# EAGLE design motor kontrol v1 (EAGLE 9.6.2)
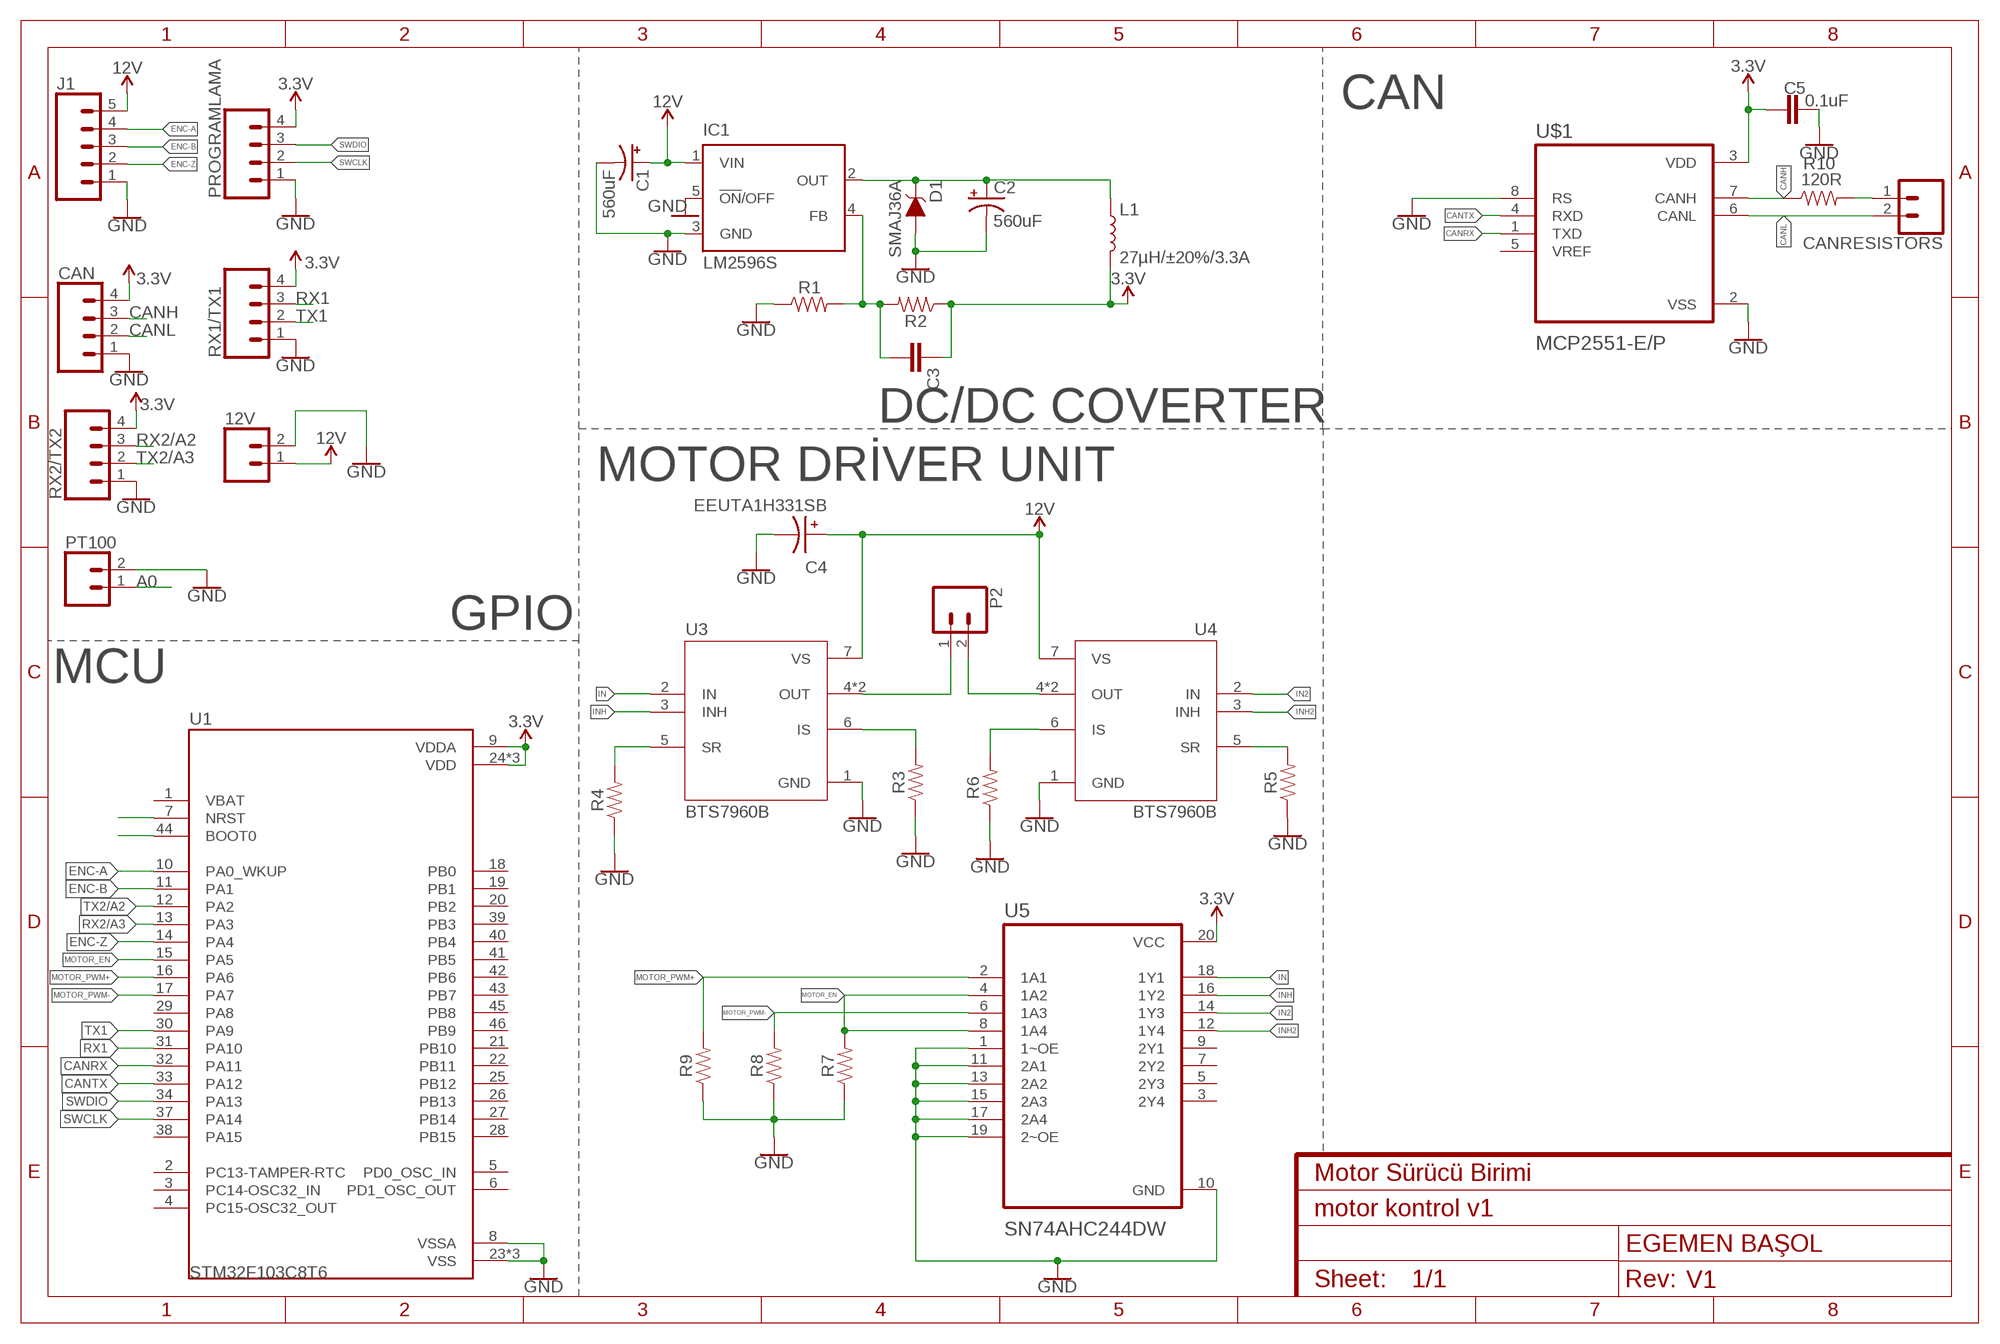
[diagram p0: schematic, sheet 1]
FRAME1 (FRAME-A4L): CNAME: Motor Sürücü Birimi; CREVISION: V1; DESIGNER: EGEMEN BAŞOL

## Parts
12V  CONN_023.5MM_LOCK  [SCREWTERMINAL-3.5MM-2_LOCK]
C1  560uF  560UF-PANASONIC_G-25V-20%  [PANASONIC_G]
C2  560uF  560UF-PANASONIC_G-25V-20%  [PANASONIC_G]
C3  CAP-0805  [0805]
C4  EEUTA1H331SB  [CAPPRD750W80D1600H1500]
C5  0.1uF  CAP-0805  [0805]
CAN  CONN_04SCREW_LOCK  [SCREWTERMINAL-3.5MM-4_LOCK]
CANRESISTORS  CONN_02LOCK_LONGPADS  [1X02_LOCK_LONGPADS]
D1  SMAJ36A  DIODE_TVS_UNI  [DO-214AC]
IC1  LM2596S  [TO263-5]
J1  CONN_05SCREW  [SCREWTERMINAL-3.5MM-5]
L1  27µH/±20%/3.3A  INDUCTOR-SDR13-27UH  [INDUCTOR_SDR1307]
P2  CONN_023.5MM_LOCK  [SCREWTERMINAL-3.5MM-2_LOCK]
PROGRAMLAMA  CONN_04SCREW_LOCK  [SCREWTERMINAL-3.5MM-4_LOCK]
PT100  CONN_023.5MM_LOCK  [SCREWTERMINAL-3.5MM-2_LOCK]
R1  RESISTOR0805  [0805]
R2  RESISTOR0805  [0805]
R3  RESISTOR0805  [0805]
R4  RESISTOR0805  [0805]
R5  RESISTOR0805  [0805]
R6  RESISTOR0805  [0805]
R7  RESISTOR0805  [0805]
R8  RESISTOR0805  [0805]
R9  RESISTOR0805  [0805]
R10  120R  RESISTOR0805  [0805]
RX1/TX1  CONN_04SCREW_LOCK  [SCREWTERMINAL-3.5MM-4_LOCK]
RX2/TX2  CONN_04SCREW_LOCK  [SCREWTERMINAL-3.5MM-4_LOCK]
U1  STM32F103C8T6  [QFP50P900X900X160-48N]
U3  BTS7960B  [DPAK127P1490X440-8N]
U4  BTS7960B  [DPAK127P1490X440-8N]
U5  SN74AHC244DW  [SOIC127P1030X265-20N]
U$1  MCP2551-E/P  [DIP787W46P254L927H533Q8]

## Nets
3.3V: C3.1 C5.2 CAN.4 L1.P$2 PROGRAMLAMA.4 R2.1 RX1/TX1.4 RX2/TX2.4 U1.9(VDDA) U1.24(VDD) U1.36(VDD) U1.48(VDD) U5.20(VCC) U$1.3(VDD)
12V: 12V.1 C1.+ C4.P IC1.1(VIN) J1.5 U3.7(VS) U4.7(VS)
A0: PT100.1
CANH: CAN.3 R10.1 U$1.7(CANH)
CANL: CAN.2 CANRESISTORS.2 U$1.6(CANL)
CANRX: U1.32(PA11) U$1.1(TXD)
CANTX: U1.33(PA12) U$1.4(RXD)
ENC-A: J1.4 U1.10(PA0_WKUP)
ENC-B: J1.3 U1.11(PA1)
ENC-Z: J1.2 U1.14(PA4)
GND: 12V.2 C1.- C2.- C4.N C5.1 CAN.1 D1.A IC1.3(GND) IC1.5(!ON!/OFF) J1.1 PROGRAMLAMA.1 PT100.2 R1.1 R3.1 R4.1 R5.1 R6.1 R7.1 R8.1 R9.1 RX1/TX1.1 RX2/TX2.1 U1.8(VSSA) U1.23(VSS) U1.35(VSS) U1.47(VSS) U3.1(GND) U4.1(GND) U5.1(1~OE) U5.10(GND) U5.11(2A1) U5.13(2A2) U5.15(2A3) U5.17(2A4) U5.19(2~OE) U$1.2(VSS) U$1.8(RS)
IN: U3.2(IN) U5.18(1Y1)
IN2: U4.2(IN) U5.14(1Y3)
INH: U3.3(INH) U5.16(1Y2)
INH2: U4.3(INH) U5.12(1Y4)
MOTOR_EN: R7.2 U1.15(PA5) U5.4(1A2) U5.8(1A4)
MOTOR_PWM+: R9.2 U1.16(PA6) U5.2(1A1)
MOTOR_PWM-: R8.2 U1.17(PA7) U5.6(1A3)
N$1: C2.+ D1.C IC1.2(OUT) L1.P$1
N$2: C3.2 IC1.4(FB) R1.2 R2.2
N$3: P2.1 U3.4(OUT) U3.8(OUT)
N$4: P2.2 U4.4(OUT) U4.8(OUT)
N$5: CANRESISTORS.1 R10.2
N$6: R5.2 U4.5(SR)
N$7: R6.2 U4.6(IS)
N$8: R3.2 U3.6(IS)
N$9: R4.2 U3.5(SR)
N$10: U1.7(NRST)
N$11: U1.44(BOOT0)
RX1: RX1/TX1.3 U1.31(PA10)
RX2/A2: RX2/TX2.3
RX2/A3: U1.13(PA3)
SWCLK: PROGRAMLAMA.2 U1.37(PA14)
SWDIO: PROGRAMLAMA.3 U1.34(PA13)
TX1: RX1/TX1.2 U1.30(PA9)
TX2/A2: U1.12(PA2)
TX2/A3: RX2/TX2.2
Unconnected: U1.1(VBAT) U1.2(PC13-TAMPER-RTC) U1.3(PC14-OSC32_IN) U1.4(PC15-OSC32_OUT) U1.5(PD0_OSC_IN) U1.6(PD1_OSC_OUT) U1.18(PB0) U1.19(PB1) U1.20(PB2) U1.21(PB10) U1.22(PB11) U1.25(PB12) U1.26(PB13) U1.27(PB14) U1.28(PB15) U1.29(PA8) U1.38(PA15) U1.39(PB3) U1.40(PB4) U1.41(PB5) U1.42(PB6) U1.43(PB7) U1.45(PB8) U1.46(PB9) U5.3(2Y4) U5.5(2Y3) U5.7(2Y2) U5.9(2Y1) U$1.5(VREF)

## Notes on the sheet
- CAN
- DC/DC COVERTER
- MOTOR DRİVER UNIT
- GPIO
- MCU

## Library data of the parts
12V P2 PT100 = SparkFun-Connectors:CONN_02: Multi connection point. Often used as Generic Header-pin footprint for 0.1 inch spaced/style header connections On any of the 0.1 inch spaced packages, you can populate with these: Break Away Headers - Straight <https://www.sparkfun.com/products/116> (PRT-00116) Break Away Male Headers - Right Angle <https://www.sparkfun.com/products/553> (PRT-00553) Female Headers <https://www.sparkfun.com/products/115> (PRT-00115) Break Away Headers - Machine Pin <https://www.sparkfun.com/products/117> (PRT-00117) Break Away Female Headers - Swiss Machine Pin <https://www.sparkfun.com/products/743> (PRT-00743) For SCREWTERMINALS and SPRING TERMINALS visit here: Screw Terimnals on SparkFun.com <https://www.sparkfun.com/search/results?term=Screw+Terminals> (5mm/3.5mm/2.54mm spacing) This device is also useful as a general connection point to wire up your design to another part of your project. Our various solder wires solder well into these plated through hole pads. Hook-Up Wire - Assortment (Stranded, 22 AWG) <https://www.sparkfun.com/products/11375> (PRT-11375) Hook-Up Wire - Assortment (Solid Core, 22 AWG) <https://www.sparkfun.com/products/11367> (PRT-11367) View the entire wire category on our website here <https://www.sparkfun.com/categories/141> Special notes: Molex polarized connector foot print use with: PRT-08233 with associated crimp pins and housings. 2.54_SCREWTERM for use with PRT-10571. 3.5mm Screw Terminal footprints for PRT-08084 5mm Screw Terminal footprints for use with PRT-08432; PROD_ID: CONN-08399
C1 C2 = SparkFun-Capacitors:560UF: 560µF polarized capacitors A capacitor is a passive two-terminal electrical component used to store electrical energy temporarily in an electric field.; PROD_ID: CAP-09983
C3 C5 = SparkFun-Capacitors:CAP
C4 = EEUTA1H331SB:EEUTA1H331SB: TA-A Check availability <https://pricing.snapeda.com/parts/EEUTA1H331SB/Panasonic/view-part?ref=eda>; AVAILABILITY: In Stock; DESCRIPTION: CAP ALUM 330UF 20% 50V RADIAL; MF: Panasonic; MP: EEUTA1H331SB; PACKAGE: RADIAL-2 Panasonic; PRICE: None; PURCHASE-URL: https://pricing.snapeda.com/search/part/EEUTA1H331SB/?ref=eda
CAN PROGRAMLAMA RX1/TX1 RX2/TX2 = SparkFun-Connectors:CONN_04: Multi connection point. Often used as Generic Header-pin footprint for 0.1 inch spaced/style header connections On any of the 0.1 inch spaced packages, you can populate with these: Break Away Headers - Straight <https://www.sparkfun.com/products/116> (PRT-00116) Break Away Male Headers - Right Angle <https://www.sparkfun.com/products/553> (PRT-00553) Female Headers <https://www.sparkfun.com/products/115> (PRT-00115) Break Away Headers - Machine Pin <https://www.sparkfun.com/products/117> (PRT-00117) Break Away Female Headers - Swiss Machine Pin <https://www.sparkfun.com/products/743> (PRT-00743) For SCREWTERMINALS and SPRING TERMINALS visit here: Screw Terimnals on SparkFun.com <https://www.sparkfun.com/search/results?term=Screw+Terminals> (5mm/3.5mm/2.54mm spacing) This device is also useful as a general connection point to wire up your design to another part of your project. Our various solder wires solder well into these plated through hole pads. Hook-Up Wire - Assortment (Stranded, 22 AWG) <https://www.sparkfun.com/products/11375> (PRT-11375) Hook-Up Wire - Assortment (Solid Core, 22 AWG) <https://www.sparkfun.com/products/11367> (PRT-11367) View the entire wire category on our website here <https://www.sparkfun.com/categories/141> Special notes: Molex polarized connector foot print use with SKU : PRT-08231 with associated crimp pins and housings. 1MM SMD Version SKU: PRT-10208
CANRESISTORS = SparkFun-Connectors:CONN_02: Multi connection point. Often used as Generic Header-pin footprint for 0.1 inch spaced/style header connections On any of the 0.1 inch spaced packages, you can populate with these: Break Away Headers - Straight <https://www.sparkfun.com/products/116> (PRT-00116) Break Away Male Headers - Right Angle <https://www.sparkfun.com/products/553> (PRT-00553) Female Headers <https://www.sparkfun.com/products/115> (PRT-00115) Break Away Headers - Machine Pin <https://www.sparkfun.com/products/117> (PRT-00117) Break Away Female Headers - Swiss Machine Pin <https://www.sparkfun.com/products/743> (PRT-00743) For SCREWTERMINALS and SPRING TERMINALS visit here: Screw Terimnals on SparkFun.com <https://www.sparkfun.com/search/results?term=Screw+Terminals> (5mm/3.5mm/2.54mm spacing) This device is also useful as a general connection point to wire up your design to another part of your project. Our various solder wires solder well into these plated through hole pads. Hook-Up Wire - Assortment (Stranded, 22 AWG) <https://www.sparkfun.com/products/11375> (PRT-11375) Hook-Up Wire - Assortment (Solid Core, 22 AWG) <https://www.sparkfun.com/products/11367> (PRT-11367) View the entire wire category on our website here <https://www.sparkfun.com/categories/141> Special notes: Molex polarized connector foot print use with: PRT-08233 with associated crimp pins and housings. 2.54_SCREWTERM for use with PRT-10571. 3.5mm Screw Terminal footprints for PRT-08084 5mm Screw Terminal footprints for use with PRT-08432
D1 = SparkFun-DiscreteSemi:DIODE_TVS_UNI; PROD_ID: DIO-15812
IC1 = national-semiconductor:LM2596: SIMPLE SWITCHER® Power Converter 150 kHz 3A Step-Down Voltage Regulator Source: http://www.national.com/ds/LM/LM2596.pdf; MF: NATIONAL SEMICONDUCTOR; MPN: LM2596S-ADJ/NOPB; OC_FARNELL: 9494367; OC_NEWARK: 41K3842
J1 = SparkFun-Connectors:CONN_05: Multi connection point. Often used as Generic Header-pin footprint for 0.1 inch spaced/style header connections On any of the 0.1 inch spaced packages, you can populate with these: Break Away Headers - Straight <https://www.sparkfun.com/products/116> (PRT-00116) Break Away Male Headers - Right Angle <https://www.sparkfun.com/products/553> (PRT-00553) Female Headers <https://www.sparkfun.com/products/115> (PRT-00115) Break Away Headers - Machine Pin <https://www.sparkfun.com/products/117> (PRT-00117) Break Away Female Headers - Swiss Machine Pin <https://www.sparkfun.com/products/743> (PRT-00743) For SCREWTERMINALS and SPRING TERMINALS visit here: Screw Terimnals on SparkFun.com <https://www.sparkfun.com/search/results?term=Screw+Terminals> (5mm/3.5mm/2.54mm spacing) This device is also useful as a general connection point to wire up your design to another part of your project. Our various solder wires solder well into these plated through hole pads. Hook-Up Wire - Assortment (Stranded, 22 AWG) <https://www.sparkfun.com/products/11375> (PRT-11375) Hook-Up Wire - Assortment (Solid Core, 22 AWG) <https://www.sparkfun.com/products/11367> (PRT-11367) View the entire wire category on our website here <https://www.sparkfun.com/categories/141> Special notes: Molex polarized connector foot print use with SKU : PRT-08231 with associated crimp pins and housings. 1MM SMD Version SKU: PRT-10208; PROD_ID: Combine 8288+8399
L1 = SparkFun-Coils:INDUCTOR: Inductors Resist changes in electrical current. Basically a coil of wire. SparkFun Products: SparkFun Load Cell Amplifier - HX711 <https://www.sparkfun.com/products/13879> IOIO-OTG - V2.2 <https://www.sparkfun.com/products/13613>; PROD_ID: NDUC-12529
R1-R10 = SparkFun-Resistors:RESISTOR: Generic Resistor Package
U1 = STM32F103C8T6:STM32F103C8T6: Mainstream Performance line, ARM Cortex-M3 MCU with 64 Kbytes Flash, 72 MHz CPU, motor control, USB and CAN Check availability <https://pricing.snapeda.com/parts/STM32F103C8T6/STMicroelectronics/view-part?ref=eda>; AVAILABILITY: In Stock; DESCRIPTION: ARM® Cortex®-M3 STM32F1 Microcontroller IC 32-Bit 72MHz 64KB (64K x 8) FLASH 48-LQFP (7x7); MF: STMicroelectronics; MP: STM32F103C8T6; PACKAGE: LQFP-48 STMicroelectronics; PRICE: None; PURCHASE-URL: https://pricing.snapeda.com/search/part/STM32F103C8T6/?ref=eda
U3 U4 = BTS7960B:BTS7960B: Half Bridge Motor Driver 7-Pin(6+Tab) TO-263 Check availability <https://pricing.snapeda.com/parts/BTS7960B/Infineon/view-part?ref=eda>; AVAILABILITY: In Stock; DESCRIPTION: Half Bridge Driver DC Motors, General Purpose DMOS PG-TO263-7-1; MF: Infineon; MP: BTS7960B; PACKAGE: TO-263 Infineon; PRICE: None; PURCHASE-URL: https://pricing.snapeda.com/search/part/BTS7960B/?ref=eda
U5 = SN74AHC244DW:SN74AHC244DW: Check availability <https://pricing.snapeda.com/parts/SN74AHC244DW/Texas%20Instruments/view-part?ref=eda>; AVAILABILITY: In Stock; DESCRIPTION: 8-ch, 2-V to 5.5-V buffers with 3-state outputs; MF: Texas Instruments; MP: SN74AHC244DW; PACKAGE: SOIC-20 Texas Instruments; PRICE: None; PURCHASE-URL: https://pricing.snapeda.com/search/part/SN74AHC244DW/?ref=eda
U$1 = MCP2551-E_P:MCP2551-E/P: Check availability <https://pricing.snapeda.com/parts/MCP2551-E/P/Microchip/view-part?ref=eda>; AVAILABILITY: In Stock; DESCRIPTION: 1/1 Transceiver Half CANbus 8-PDIP; MF: Microchip; MP: MCP2551-E/P; PACKAGE: DIP-8 Microchip; PRICE: None; PURCHASE-URL: https://pricing.snapeda.com/search/part/MCP2551-E/P/?ref=eda

## Board
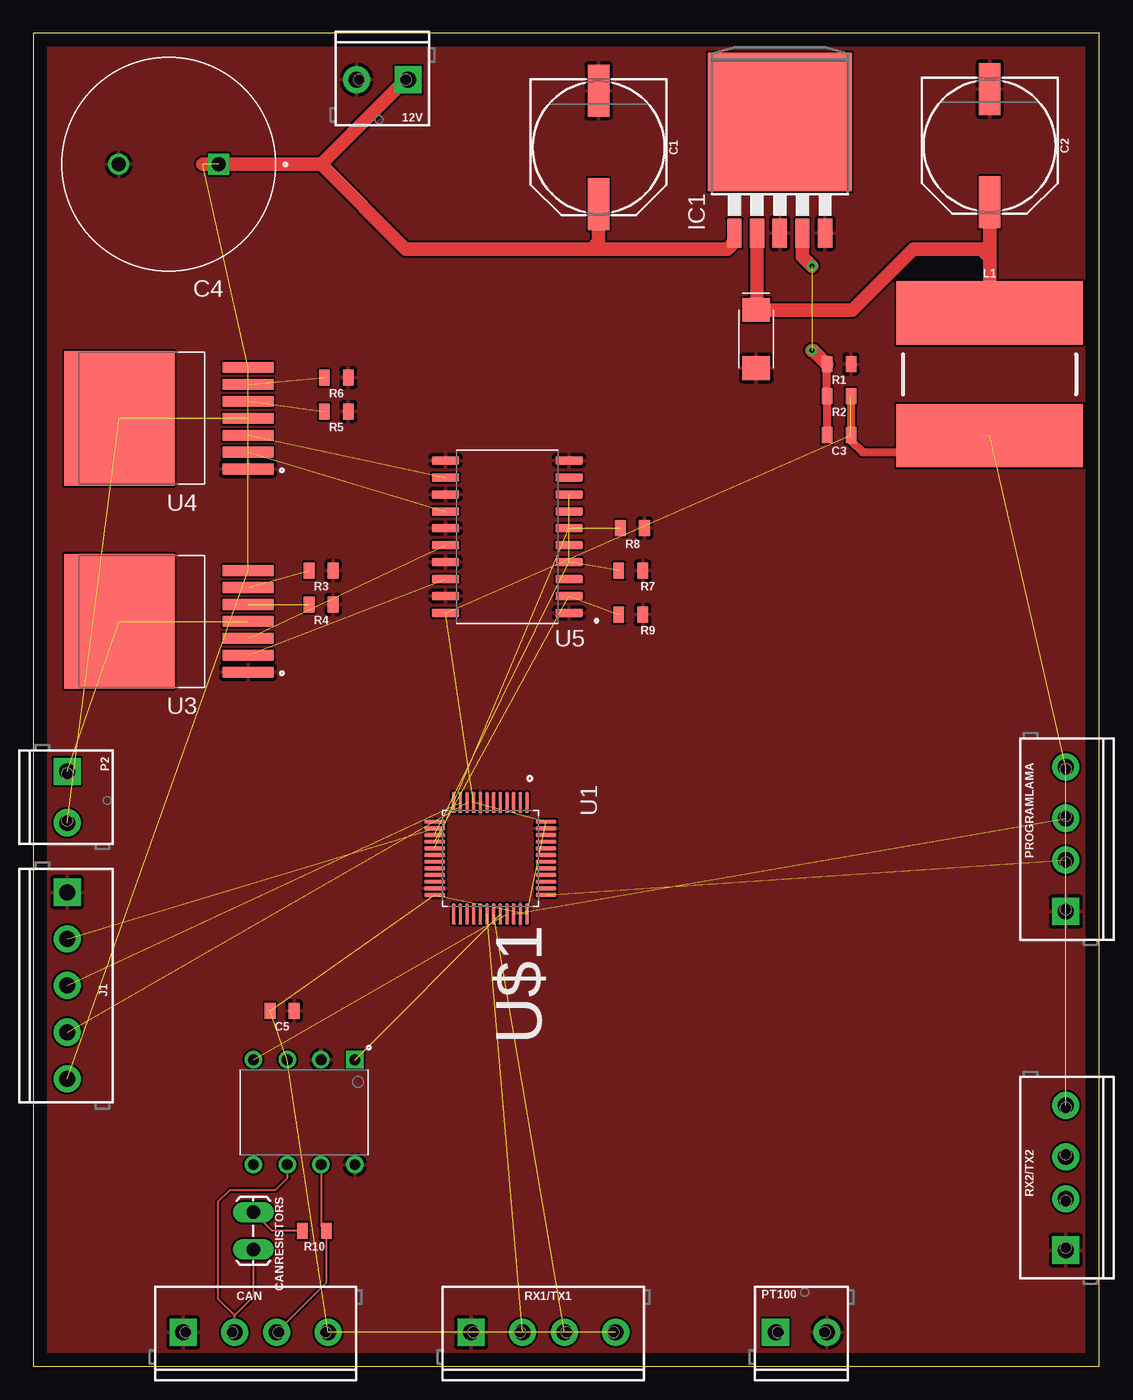
[diagram p1: board, top side]
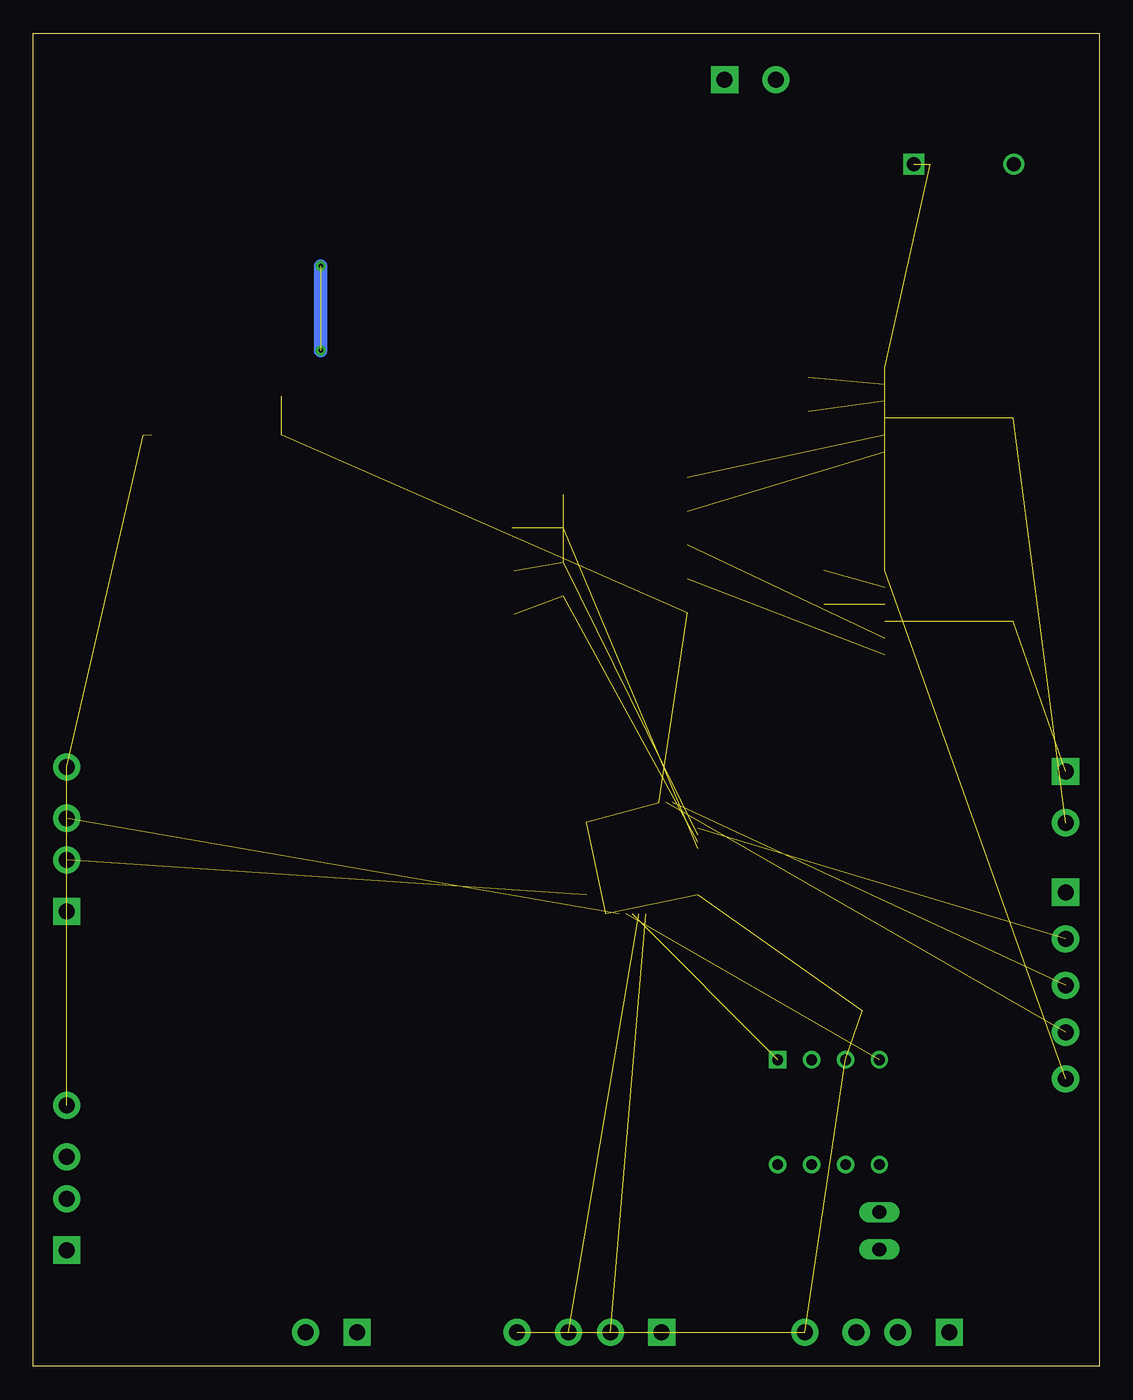
[diagram p2: board, bottom side, seen from below]

Size 79.99 x 100 mm. Coordinates in mm from the lower left corner, seen from the top.
Outline: 0,0 79.99,0 79.99,100 0,100 0,0
Copper layers (1*16): Top 0.035mm / dielectric 1.5mm / Bottom 0.035mm
Design rules "default": minimum track width 6mil, minimum drill 0.35mm, track to track 6mil, track to pad 6mil, pad to pad 6mil, via to via 6mil, smd to smd 6mil, copper to edge 40mil, drill to drill 6mil, minimum pad ring 10mil, minimum via ring 8mil, stop-mask expansion 4mil, vias tented up to drill 0mil, thermal gap 10mil

### Footprints (pad centres in the part's own frame; a part is rotated, then mirrored left to right if it is on the bottom)
SCREWTERMINAL-3.5MM-2_LOCK = drill 1.2 pad 2.032 square: 1 -0.178,0 | drill 1.2 pad 2.032: 2 3.678,0
PANASONIC_G = smd 3.9 x 1.6: + 4.25,0; - -4.25,0
0805 = smd 0.8 x 1.2: 1 -0.9,0; 2 0.9,0
CAPPRD750W80D1600H1500 = drill 1.05 pad 1.4: N 3.75,0 | drill 1.05 pad 1.4 square: P -3.75,0
SCREWTERMINAL-3.5MM-4_LOCK = drill 1.2 pad 2.032 square: 1 -0.178,0 | drill 1.2 pad 2.032: 2 3.678,0; 3 6.822,0; 4 10.678,0
1X02_LOCK_LONGPADS = drill 1.016 long: 1 -0.127,0; 2 2.667,0
DO-214AC = smd 1.778 x 2.083: A 2.21,0; C -2.159,0
TO263-5 = smd 1.067 x 2.159: 1 -3.404,-5.791; 2 -1.702,-5.791; 3 0,-5.791; 4 1.702,-5.791; 5 3.404,-5.791 | smd 10.8 x 10.41: 6 0,2.54
SCREWTERMINAL-3.5MM-5 = drill 1.2 pad 2.032 square: 1 0,0 | drill 1.2 pad 2.032: 2 3.5,0; 3 7,0; 4 10.5,0; 5 14,0
INDUCTOR_SDR1307 = smd 14 x 4.75: P$1 0,4.6; P$2 0,-4.6
QFP50P900X900X160-48N = smd 1.56 x 0.28: 1 -4.18,2.75; 2 -4.18,2.25; 3 -4.18,1.75; 4 -4.18,1.25; 5 -4.18,0.75; 6 -4.18,0.25; 7 -4.18,-0.25; 8 -4.18,-0.75; 9 -4.18,-1.25; 10 -4.18,-1.75; 11 -4.18,-2.25; 12 -4.18,-2.75; 25 4.18,-2.75; 26 4.18,-2.25; 27 4.18,-1.75; 28 4.18,-1.25; 29 4.18,-0.75; 30 4.18,-0.25; 31 4.18,0.25; 32 4.18,0.75; 33 4.18,1.25; 34 4.18,1.75; 35 4.18,2.25; 36 4.18,2.75 | smd 0.28 x 1.56: 13 -2.75,-4.18; 14 -2.25,-4.18; 15 -1.75,-4.18; 16 -1.25,-4.18; 17 -0.75,-4.18; 18 -0.25,-4.18; 19 0.25,-4.18; 20 0.75,-4.18; 21 1.25,-4.18; 22 1.75,-4.18; 23 2.25,-4.18; 24 2.75,-4.18; 37 2.75,4.18; 38 2.25,4.18; 39 1.75,4.18; 40 1.25,4.18; 41 0.75,4.18; 42 0.25,4.18; 43 -0.25,4.18; 44 -0.75,4.18; 45 -1.25,4.18; 46 -1.75,4.18; 47 -2.25,4.18; 48 -2.75,4.18
DPAK127P1490X440-8N = smd 3.81 x 0.8: 1 -5.95,3.81; 2 -5.95,2.54; 3 -5.95,1.27; 4 -5.95,0; 5 -5.95,-1.27; 6 -5.95,-2.54; 7 -5.95,-3.81 | smd 8.29 x 10.07: 8 3.71,0
SOIC127P1030X265-20N = smd 2.06 x 0.6: 1 -4.64,5.715; 2 -4.64,4.445; 3 -4.64,3.175; 4 -4.64,1.905; 5 -4.64,0.635; 6 -4.64,-0.635; 7 -4.64,-1.905; 8 -4.64,-3.175; 9 -4.64,-4.445; 10 -4.64,-5.715; 11 4.64,-5.715; 12 4.64,-4.445; 13 4.64,-3.175; 14 4.64,-1.905; 15 4.64,-0.635; 16 4.64,0.635; 17 4.64,1.905; 18 4.64,3.175; 19 4.64,4.445; 20 4.64,5.715
DIP787W46P254L927H533Q8 = drill 0.8 square: 1 -3.935,3.81 | drill 0.8: 2 -3.935,1.27; 3 -3.935,-1.27; 4 -3.935,-3.81; 5 3.935,-3.81; 6 3.935,-1.27; 7 3.935,1.27; 8 3.935,3.81

### Placement (x,y rotation side)
12V  27.94,96.52 180 top
C1  42.42,91.44 270 top
C2  71.75,91.57 270 top
C3  60.45,69.85 180 top
C4  10.16,90.17 180 top
C5  18.67,26.67 180 top
CAN  11.43,2.54 0 top
CANRESISTORS  16.51,11.43 270 top
D1  54.23,77.09 270 top
IC1  56.01,90.81 0 top
J1  2.54,35.56 270 top
L1  71.75,74.42 0 top
P2  2.54,44.45 270 top
PROGRAMLAMA  77.47,34.29 90 top
PT100  55.88,2.54 0 top
R1  60.45,75.18 180 top
R2  60.45,72.77 180 top
R3  21.59,59.69 180 top
R4  21.59,57.15 180 top
R5  22.73,71.63 180 top
R6  22.73,74.17 180 top
R7  44.83,59.69 180 top
R8  44.96,62.87 180 top
R9  44.83,56.39 180 top
R10  21.08,10.16 180 top
RX1/TX1  33.02,2.54 0 top
RX2/TX2  77.47,8.89 90 top
U1  34.29,38.1 270 top
U3  10.16,55.88 180 top
U4  10.16,71.12 180 top
U5  35.56,62.23 180 top
U$1  20.32,19.05 270 top

### Tracks (layer width: path | path; a pad name or v marks a point on that pad's centre or on a via)
3.3V  (13 unrouted)
  Top 0.61: R2.1 61.35,69.46 62.23,68.58 69.85,68.58 71.12,69.85
12V  (4 unrouted)
  Top 1.016: 12V.1 27.94,96.52 21.59,90.17 | 21.59,90.17 12.7,90.17 | C1.+ 42.42,84.33 41.91,83.82 | 41.91,83.82 27.94,83.82 21.59,90.17 | 41.91,83.82 52.07,83.82 52.6,84.35 IC1.1
CANH
  Top 0.152: U$1.7 21.59,10.55 R10.1 21.98,6.27 CAN.3
CANL
  Top 0.152: U$1.6 19.05,14.1 18.16,13.21 14.73,13.21 13.84,12.32 13.84,5.08 15.11,3.81 | CAN.2 15.11,3.81 | CANRESISTORS.2 16.51,5.21 15.11,3.81
CANRX  (1 unrouted)
CANTX  (1 unrouted)
ENC-A  (1 unrouted)
ENC-B  (1 unrouted)
ENC-Z  (1 unrouted)
GND
  pour Top: -35.56,101.6 -35.56,-2.54 91.44,-2.54 91.44,107.95 -29.21,107.95
IN  (1 unrouted)
IN2  (1 unrouted)
INH  (1 unrouted)
INH2  (1 unrouted)
MOTOR_EN  (3 unrouted)
MOTOR_PWM+  (2 unrouted)
MOTOR_PWM-  (2 unrouted)
N$1
  Top 1.016: IC1.2 54.3,79.32 D1.C 61.47,79.25 66.04,83.82 71.12,83.82 71.75,83.19 | C2.+ 71.75,83.19 | L1.P$1 71.75,82.55 71.75,83.19
N$2  (via drill 0.35)  (1 unrouted)
  Top 0.61: C3.2 R2.2 R1.2
  Top 1.016: IC1.4 57.71,83.26 v58.42,82.55 | v58.42,76.2 58.54,76.2 R1.2
  Bottom 1.016: v58.42,82.55 v58.42,76.2
N$3  (2 unrouted)
N$4  (2 unrouted)
N$5
  Top 0.152: R10.2 17.91,10.16 CANRESISTORS.1
N$6  (1 unrouted)
N$7  (1 unrouted)
N$8  (1 unrouted)
N$9  (1 unrouted)
RX1  (1 unrouted)
SWCLK  (1 unrouted)
SWDIO  (1 unrouted)
TX1  (1 unrouted)